# Altium project Telit-GPS-SL871-Module-V1.1.PrjPcb
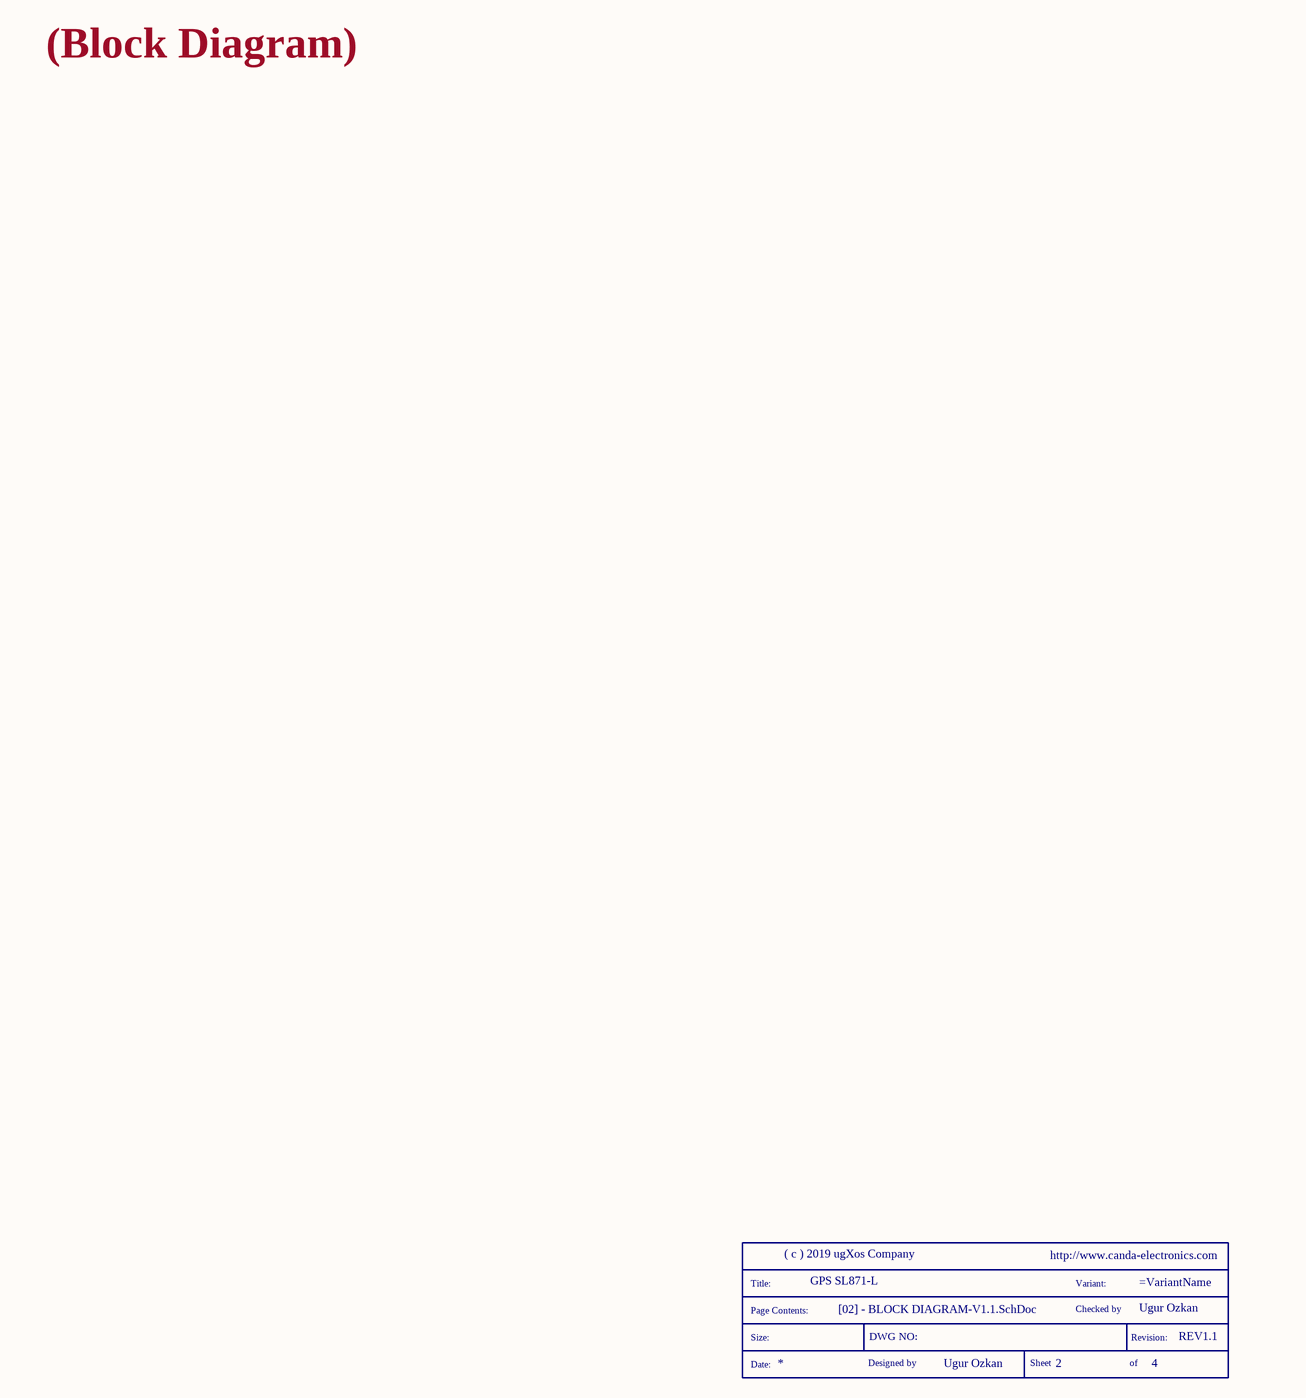
[diagram p0: [02] - BLOCK DIAGRAM-V1.1.SchDoc]
Company: ( c ) 2019 ugXos Company; Designer: Ugur Ozkan; NotFitted: NF; Project: GPS SL871-L; VersionRevision: REV1.1; WebSite: http://www.canda-electronics.com
3 sheets, 20 parts. Net scope: flat (ports and power ports of the same name join across sheets).
Board files: Telit-GPS-SL871-Module-V1.1.PcbDoc, Telit-GPS-SL871-Panel-V1.1.PcbDoc
Sheets:
  [02] - BLOCK DIAGRAM-V1.1.SchDoc
  [03] - GPS-SL871-Module-V1.1.SchDoc
  [04] - REVISION HISTORY-V1.1.SchDoc

## Sheet [02] - BLOCK DIAGRAM-V1.1.SchDoc
size A3; DocumentNumber: 2; SheetNumber: 2; SheetTotal: 4; PageSetup: Record=PageOptions|CenterHorizontal=True|CenterVertical=True|PrintScale=0.52|XCorrection=1.00|YCorrection=1.00|PrintKind=1|BorderSize=5000000|LeftOffset=0|BottomOffset=0|Orientation=2|PaperLength=1000|PaperWidth=1000|Scale=100|PaperSource=4|PrintQuality=600|MediaType=1|DitherType=10|PrintScaleMode=1|PaperKind=A4|PaperIndex=9

### Parts
(Parts that share a designator on the sheet are numbered #1, #2 ... from top to bottom, then left to right.)
*#1  SCH_TITLE  (value not drawn)  (graphical)

### Notes on the sheet
- (Block Diagram)
- (in symbol SCH_TITLE) Title:; Variant:; Page Contents:; Checked by; Size:; DWG NO:; Revision:; Date:; Designed by; Sheet; of

## Sheet [03] - GPS-SL871-Module-V1.1.SchDoc
size A4; DocumentNumber: 3; SheetNumber: 3; SheetTotal: 4
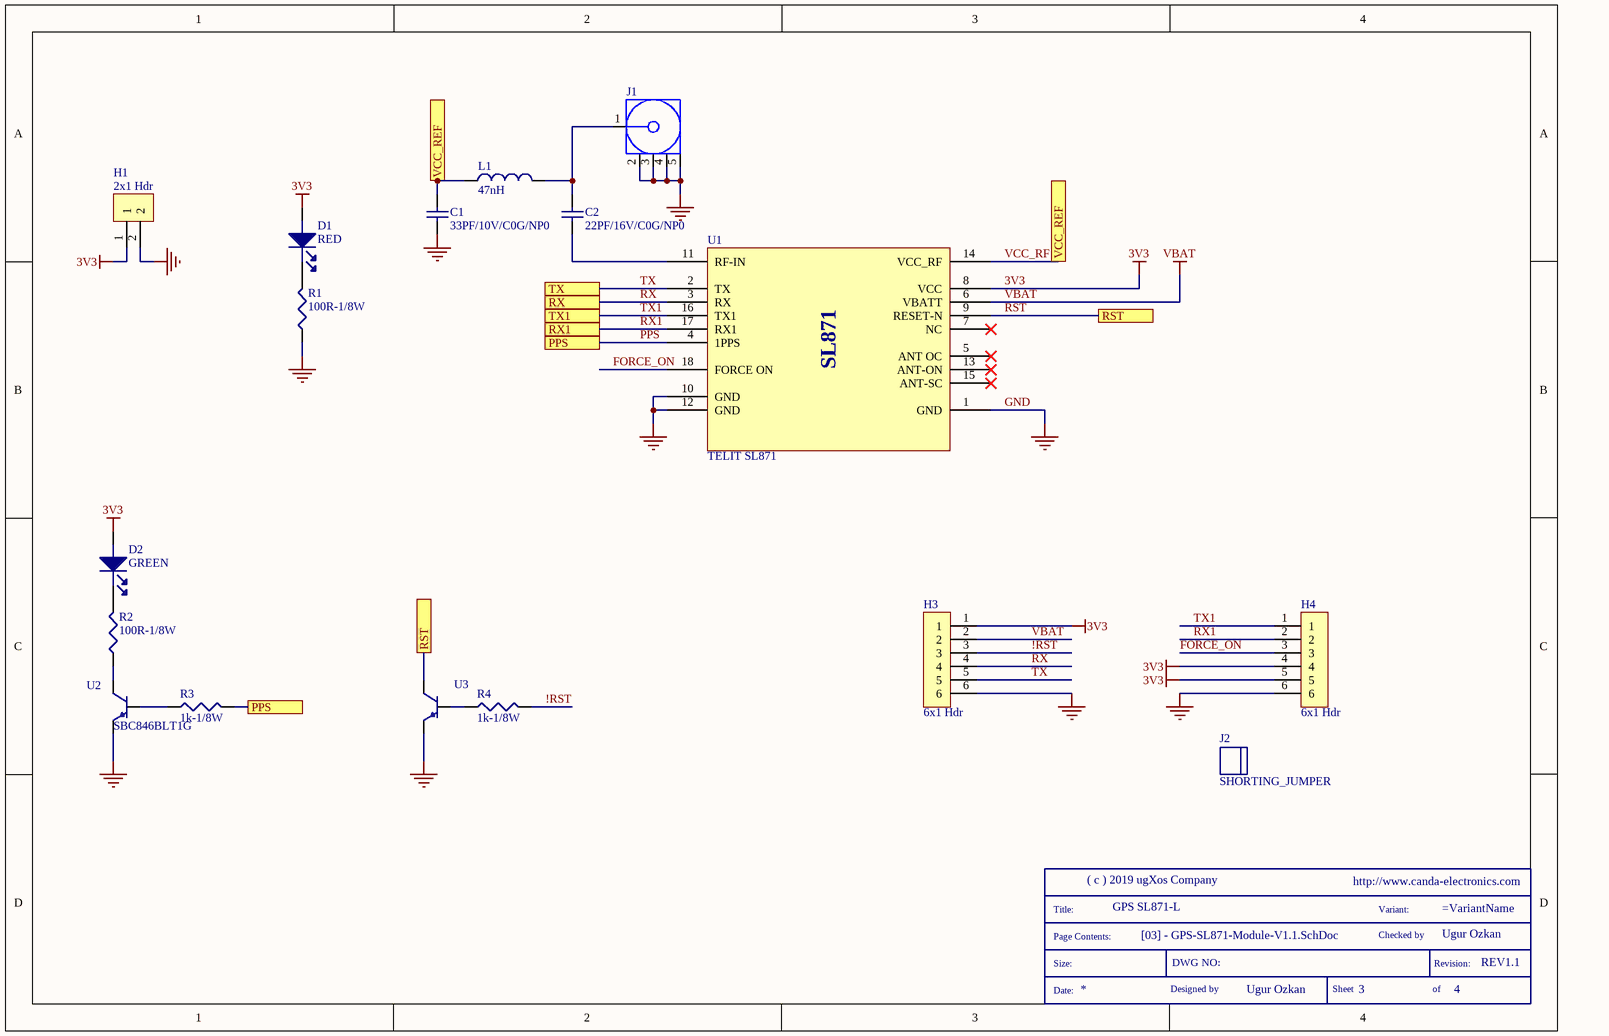
[diagram p1: [03] - GPS-SL871-Module-V1.1.SchDoc]

### Parts
(Parts that share a designator on the sheet are numbered #1, #2 ... from top to bottom, then left to right.)
*#2  SCH_TITLE  (value not drawn)  (graphical)
C1  33PF/10V/C0G/NP0  [CAP0805]
C2  22PF/16V/C0G/NP0  [CAP0805]
D1  RED  [LED_0805]
D2  GREEN  [LED_0805]
H1  2x1 Hdr  [Hdr_Male_1x2_2.54mm]
H3  6x1 Hdr  [Hdr_Female_1x6_2.54mm]
H4  6x1 Hdr  [Hdr_Female_1x6_2.54mm]
J1  WR-SMA-THT  [WR_SMA_THT_60311002114501]  (value not drawn)
J2  SHORTING_JUMPER  (graphical)
L1  47nH  [L0805]
R1  100R-1/8W  [R0805]
R2  100R-1/8W  [R0805]
R3  1k-1/8W  [R0805]
R4  1k-1/8W  [R0805]
U1  TELIT SL871  [Telit_SL871]
U2  SBC846BLT1G  [SOT-23]
U3  SBC846BLT1G  [SOT-23]  (value not drawn)

### Ports
PPS, RST, RX, RX1, TX, TX1, VCC_REF

### Nets
3V3: D1.1(Anode) D2.1(Anode) H1.1 H3.1 H4.4 H4.5 U1.8(VCC)
GND: C1.2 H1.2 H3.6 H4.6 J1.2(GND) J1.3(GND) J1.4(GND) J1.5(GND) R1.1 U1.1(GND) U1.10(GND) U1.12(GND) U2.2(E) U3.2(E)
VBAT: H3.2 U1.6(VBATT)
!RST: H3.3 R4.2
FORCE_ON: H4.3 U1.18(FORCE_ON)
PPS: R3.2 U1.4(1PPS) ; port PPS
RST: U1.9(RESET-N) U3.3(C) ; port RST
RX: H3.4 U1.3(RX) ; port RX
RX1: H4.2 U1.17(RX1) ; port RX1
TX: H3.5 U1.2(TX) ; port TX
TX1: H4.1 U1.16(TX1) ; port TX1
VCC_RF: C1.1 L1.1 U1.14(VCC_RF) ; port VCC_REF
NetC2_1: C2.1 U1.11(RF-IN)
NetC2_2: C2.2 J1.1(Signal) L1.2
NetD1_2: D1.2(Cathode) R1.2
NetD2_2: D2.2(Cathode) R2.2
NetR2_1: R2.1 U2.3(C)
NetR3_1: R3.1 U2.1(B)
NetR4_1: R4.1 U3.1(B)

Not connected (* = marked no-connect by the designer): U1 5(ANT_OC)* 7(NC)* 13(ANT-ON)* 15(ANT-SC)*

### Notes on the sheet
- (in symbol SCH_TITLE) Title:; Variant:; Page Contents:; Checked by; Size:; DWG NO:; Revision:; Date:; Designed by; Sheet; of
- (in symbol TELIT SL871) SL871

### Library data of the parts
C1 = 885012007003: CAP CER 33PF 10V C0G/NP0 0805; Manufacturer: Wurth Electronics; Tolerance: 5%; Supplier 1: Digi-Key; Manufacturer Part Number: 885012007003; RoHS: Yes; Stock 1: 2029; Pricing 1: 1 = 0,10000, 10 = 0,04100, 100 = 0,03690, 500 = 0,03262 (USD); Mount: Surface Mount; Case/Package: 0805; Case Code (Metric): 2012; Case Code (Imperial): 0805; Min Operating Temperature: -55°C; Max Operating Temperature: 125°C; Packaging: Tape and Reel; Capacitance: 33pF; Voltage Rating: 10V; Length: 0.079inch; Width: 0.049inch; Thickness: 0.028inch; Supplier Part Number 1: 732-7808-1-ND; Category: Capacitors
C2 = 885012007012: CAP CER 22PF 16V C0G/NP0 0805; Manufacturer: Wurth Electronics; Tolerance: 5%; Supplier 1: Digi-Key; Manufacturer Part Number: 885012007012; RoHS: Yes; Stock 1: 22; Pricing 1: 1 = 0,10000, 10 = 0,04300, 100 = 0,03830, 500 = 0,03390 (USD); Mount: Surface Mount; Case/Package: 0805; Case Code (Metric): 2012; Case Code (Imperial): 0805; Min Operating Temperature: -55°C; Max Operating Temperature: 125°C; Packaging: Tape and Reel; Capacitance: 22pF; Voltage Rating: 16V; Length: 0.079inch; Width: 0.049inch; Thickness: 0.028inch; Supplier Part Number 1: 732-7816-1-ND; Category: Capacitors
D1 = 150080RS75000: LED, 0805, RED, 150MCD, 625NM; Manufacturer: Wurth Electronics; Viewing Angle: 140°; Forward Voltage: 2V; Lens Style: Clear,Rectangular; Forward Current: 30mA; Test Current: 20mA; Supplier 1: Digi-Key; Manufacturer Part Number: 150080RS75000; RoHS: Yes; Stock 1: 58016; Pricing 1: 1 = 0,17000, 50 = 0,16000, 100 = 0,13700, 500 = 0,11800 (USD); Mount: Surface Mount; Case/Package: 0805; Color: Red; Case Code (Metric): 2012; Case Code (Imperial): 0805; Min Operating Temperature: -40°C; Max Operating Temperature: 85°C; Luminous Intensity: 150mcd; Wavelength: 625nm; Package Quantity: 4000; Packaging: Tape and Reel; Dominant Wavelength: 625nm; Length: 2mm; Height: 0.7mm; Width: 1.25mm; REACH SVHC: Unknown; ComponentLink1URL: http://www.farnell.com/datasheets/1911350.pdf?src-supplier=Element14; ComponentLink1Description: http://www.farnell.com/datasheets/1911350.pdf?src-supplier=Element14; ComponentLink2URL: http://www.produktinfo.conrad.com/datenblaetter/750000-774999/759435-da-01-en-CHIPLED_0805_W_KL_ROT_150080RS75000.pdf?src-supplier=Conrad; ComponentLink2Description: http://www.produktinfo.conrad.com/datenblaetter/750000-774999/759435-da-01-en-CHIPLED_0805_W_KL_ROT_150080RS75000.pdf?src-supplier=Conrad; Supplier Part Number 1: 732-4984-1-ND; Category: Optoelectronics
D2 = 150080VS75000: LED, 0805, B GREEN, 40MCD, 570NM; Manufacturer: Wurth Electronics; Forward Current: 30mA; Forward Voltage: 2V; Viewing Angle: 140°; Lens Style: Clear,Rectangular; Test Current: 20mA; Supplier 1: Digi-Key; Manufacturer Part Number: 150080VS75000; RoHS: Yes; Stock 1: 80308; Pricing 1: 1 = 0,17000, 50 = 0,16000, 100 = 0,13700, 500 = 0,11800 (USD); Mount: Surface Mount; Case/Package: 0805; Color: Green; Case Code (Metric): 2012; Case Code (Imperial): 0805; Min Operating Temperature: -40°C; Max Operating Temperature: 85°C; Luminous Intensity: 40mcd; Wavelength: 570nm; Package Quantity: 4000; Packaging: Tape and Reel; Dominant Wavelength: 570nm; Length: 2mm; Height: 0.7mm; Width: 1.25mm; REACH SVHC: Unknown; ComponentLink1URL: http://www.farnell.com/datasheets/1911352.pdf?src-supplier=Element14; ComponentLink1Description: http://www.farnell.com/datasheets/1911352.pdf?src-supplier=Element14; ComponentLink2URL: https://katalog.we-online.de/led/datasheet/150080VS75000.pdf?src-supplier=Digi-Key; ComponentLink2Description: https://katalog.we-online.de/led/datasheet/150080VS75000.pdf?src-supplier=Digi-Key; ComponentLink3URL: http://www.produktinfo.conrad.com/datenblaetter/750000-774999/759437-da-01-en-CHIPLED_0805_W_KL_H_GRUEN_150080VS7500.pdf?src-supplier=Conrad; ComponentLink3Description: http://www.produktinfo.conrad.com/datenblaetter/750000-774999/759437-da-01-en-CHIPLED_0805_W_KL_H_GRUEN_150080VS7500.pdf?src-supplier=Conrad; Supplier Part Number 1: 732-4986-1-ND; Category: Optoelectronics
H1 = 61300211121: Connector, Vertical, Through Hole, Header, 2, 2.54 Mm; Manufacturer: Wurth Electronics; Current Rating: 3A; Voltage Rating: 250V; Number of Positions: 2; Gender: Male; Connector Type: Male Pin; Pitch: 0.1inch; Supplier 1: Digi-Key; Manufacturer Part Number: 61300211121; RoHS: Yes; Stock 1: 132528; Pricing 1: 1 = 0,13000, 10 = 0,10600, 25 = 0,08800, 50 = 0,07400, 100 = 0,06700, 1000 = 0,06100 (USD); Mount: Through Hole; Contact Plating: Gold; Housing Material: PBT; Contact Material: Copper,Copper Alloy; Color: Black; Min Operating Temperature: -40°C; Max Operating Temperature: 125°C; Number of Rows: 1; Contact Gender: Male; Packaging: Bulk; Termination: Through Hole; Number of Contacts: 2; Contact Mating Length: 0.236inch; REACH SVHC: Unknown; Lead Free: Lead Free; ComponentLink1URL: http://www.mouser.com/ds/2/445/6130xx11121-538006.pdf?src-supplier=Mouser; ComponentLink1Description: http://www.mouser.com/ds/2/445/6130xx11121-538006.pdf?src-supplier=Mouser; Supplier Part Number 1: 732-5315-ND; Category: Connectors
H3 H4 = 61300611121: Connector, Vertical, Through Hole, Header 6, 2.54 Mm; Manufacturer: Wurth Electronics; Current Rating: 3A; Voltage Rating: 250V; Number of Positions: 6; Gender: Male; Connector Type: Male Pin; Pitch: 0.1inch; Supplier 1: Digi-Key; Manufacturer Part Number: 61300611121; RoHS: Yes; Stock 1: 13513; Pricing 1: 1 = 0,33000, 10 = 0,27900, 25 = 0,23200, 50 = 0,19400, 100 = 0,17600, 1000 = 0,16000 (USD); Mount: Through Hole; Contact Plating: Gold; Contact Material: Copper,Copper Alloy; Housing Material: PBT; Color: Black; Min Operating Temperature: -40°C; Max Operating Temperature: 125°C; Number of Rows: 1; Contact Gender: Male; Packaging: Bulk; Termination: Through Hole; Number of Contacts: 6; Contact Mating Length: 0.236inch; REACH SVHC: Unknown; Lead Free: Lead Free; Supplier Part Number 1: 732-5319-ND; Category: Connectors
J1 = 60311002114501: WR-SMA SMA PCB THT Jack Right Angle; Manufacturer: Wurth Electronics; Impedance: 50 Ohm; Frequency Range: DC~18 GHz; ComponentLink1Description: Manufacturer; ComponentLink1URL: http://www.we-online.de; ComponentLink2Description: Datasheet; ComponentLink2URL: https://katalog.we-online.de/em/datasheet/60311002114501.pdf; Part Number: 60311002114501; Published Date: August 2018; Publisher: Wurth Elektronik; Operating Temperature: -65 to 165 degC; Gender: Jack; Packaging: Tray; Connector Type: SMA; Orientation Type: Right Angle; Mounting Technology: THT; Manufacturer Part Number: 60311002114501; Category: Connectors
L1 = IND_0805: IND 0805
R1 R2 = ERA6AEB101V: RES SMD 100 OHM 0.1% 1/8W 0805; Manufacturer: Panasonic; Power Rating: 125mW; Voltage Rating: 100V; Resistance: 100R; Temperature Coefficient: 25ppm/°C; Supplier 1: Digi-Key; Manufacturer Part Number: ERA6AEB101V; RoHS: Yes; Stock 1: 384718; Pricing 1: 1 = 0,36000, 10 = 0,30200, 100 = 0,11820, 1000 = 0,04948, 2500 = 0,04536 (USD); Mount: Surface Mount; Case/Package: 0805; Number of Pins: 2; Case Code (Imperial): 0805; Case Code (Metric): 2012; Contact Plating: Tin; Min Operating Temperature: -55°C; Max Operating Temperature: 155°C; Tolerance: 0.1%; Packaging: Tape and Reel; Package Quantity: 1; Composition: Metal Film,Thin Film; Termination: SMD/SMT; Number of Terminations: 2; Military Standard: Not; Max Power Dissipation: 125mW; Voltage Rating (DC): 100V; Features: Automotive AEC-Q200; Length: 2mm; Height: 0.5mm; Width: 1.25mm; Depth: 1.25mm; Radiation Hardening: No; REACH SVHC: No SVHC; Lead Free: Lead Free; ComponentLink1URL: https://www.alliedelec.com/m/d/b6b0537e86f421aa7f5975bb1d8f429a.pdf?src-supplier=Allied+Electronics; ComponentLink1Description: https://www.alliedelec.com/m/d/b6b0537e86f421aa7f5975bb1d8f429a.pdf?src-supplier=Allied+Electronics; ComponentLink2URL: http://www.farnell.com/datasheets/485442.pdf?src-supplier=Farnell; ComponentLink2Description: http://www.farnell.com/datasheets/485442.pdf?src-supplier=Farnell; ComponentLink3URL: http://www.farnell.com/datasheets/485442.pdf?src-supplier=Element14; ComponentLink3Description: http://www.farnell.com/datasheets/485442.pdf?src-supplier=Element14; ComponentLink4URL: http://industrial.panasonic.com/www-data/pdf/AOA0000/AOA0000CE26.pdf?src-supplier=Avnet+Europe; ComponentLink4Description: http://industrial.panasonic.com/www-data/pdf/AOA0000/AOA0000CE26.pdf?src-supplier=Avnet+Europe; ComponentLink5URL: http://www.mouser.com/ds/2/315/AOA0000CE26-32660.pdf?src-supplier=Mouser; ComponentLink5Description: http://www.mouser.com/ds/2/315/AOA0000CE26-32660.pdf?src-supplier=Mouser; ComponentLink6URL: https://www.distrelec.biz/Web/Downloads/_t/ds/ERA_eng_tds.pdf?mime=application%2Fpdf&src-supplier=Distrelec; ComponentLink6Description: https://www.distrelec.biz/Web/Downloads/_t/ds/ERA_eng_tds.pdf?mime=application%2Fpdf&src-supplier=Distrelec; ComponentLink7URL: http://industrial.panasonic.com/www-data/pdf/AOA0000/AOA0000CE26.pdf?src-supplier=Future+Electronics; ComponentLink7Description: http://industrial.panasonic.com/www-data/pdf/AOA0000/AOA0000CE26.pdf?src-supplier=Future+Electronics; ComponentLink8URL: http://industrial.panasonic.com/www-data/pdf/AOA0000/AOA0000CE26.pdf?src-supplier=Avnet; ComponentLink8Description: http://industrial.panasonic.com/www-data/pdf/AOA0000/AOA0000CE26.pdf?src-supplier=Avnet; ComponentLink9URL: http://uk.rs-online.com/webdocs/0bee/0900766b80beefcc.pdf?src-supplier=RSComponents; ComponentLink9Description: http://uk.rs-online.com/webdocs/0bee/0900766b80beefcc.pdf?src-supplier=RSComponents; ComponentLink10URL: https://produktinfo.conrad.com/datenblaetter/450000-474999/452698-da-01-en-WIDERSTAND_0805_ERA.pdf?src-supplier=Conrad; ComponentLink10Description: https://produktinfo.conrad.com/datenblaetter/450000-474999/452698-da-01-en-WIDERSTAND_0805_ERA.pdf?src-supplier=Conrad; Supplier Part Number 1: P100DACT-ND; Category: Resistor
R3 R4 = ERA-6AED102V: Res Thin Film 0805 1K Ohm 0.5% 0.125W(1/8W) ±25ppm/C Molded SMD Automotive Punched T/R; Manufacturer: Panasonic; Resistance: 1kR; Power Rating: 125mW; Voltage Rating: 100V; Temperature Coefficient: 25ppm/°C; Supplier 1: Digi-Key; Manufacturer Part Number: ERA-6AED102V; RoHS: Yes; Stock 1: 20040; Pricing 1: 1 = 0,12000, 10 = 0,10900, 25 = 0,07520, 50 = 0,05860, 100 = 0,04180, 250 = 0,03260, 500 = 0,02592, 1000 = 0,01839 (USD); Mount: Surface Mount; Case/Package: 0805; Case Code (Imperial): 0805; Case Code (Metric): 2012; Contact Plating: Tin; Min Operating Temperature: -55°C; Max Operating Temperature: 155°C; Packaging: Tape and Reel; Tolerance: 0.5%; Package Quantity: 5000; Composition: Thin Film; Military Standard: Not; Length: 2mm; Height: 0.5mm; Width: 1.25mm; Depth: 1.25mm; Lead Free: Lead Free; ComponentLink1URL: http://industrial.panasonic.com/www-data/pdf/AOA0000/AOA0000CE26.pdf?src-supplier=Avnet; ComponentLink1Description: http://industrial.panasonic.com/www-data/pdf/AOA0000/AOA0000CE26.pdf?src-supplier=Avnet; Supplier Part Number 1: P123793CT-ND; Category: Resistor
U1 = TELIT SL871: Telit GNSS MODULE; Manufacturer Part Number: TELIT SL871; Manufacturer: Telit; Category: GSM/GPS
U2 U3 = SBC846BLT1G: BC846 NPN 65V 0.1A SOT-23; Manufacturer: ON Semiconductor; Vce Saturation (Max) @ Ib, Ic: 600mV @ 5mA, 100mA; Current - Collector Cutoff (Max): 15nA (ICBO); DC Current Gain (hFE) (Min) @ Ic, Vce: 200 @ 2mA, 5V; Frequency - Transition: 100MHz; Supplier 1: Digi-Key; Manufacturer Part Number: SBC846BLT1G; RoHS: RoHS Compliant; Category: Discrete Semiconductor Products; Stock 1: 23802; Pricing 1: 1=0.31, 10=0.256, 100=0.1356, 500=0.08922, 1000=0.06067 (USD); Packaging: Cut Tape (CT); Part Status: Active; Transistor Type: NPN; Operating Temperature: -55°C ~ 150°C (TJ); Mounting Type: Surface Mount; Package / Case: TO-236-3, SC-59, SOT-23-3; Supplier Device Package: SOT-23-3 (TO-236); ComponentLink1URL: http://www.onsemi.com/pub/Collateral/BC846ALT1-D.PDF; ComponentLink1Description: http://www.onsemi.com/pub/Collateral/BC846ALT1-D.PDF; Supplier Part Number 1: SBC846BLT1GOSCT-ND

## Sheet [04] - REVISION HISTORY-V1.1.SchDoc
size A3; DocumentNumber: 4; SheetNumber: 4; SheetTotal: 4
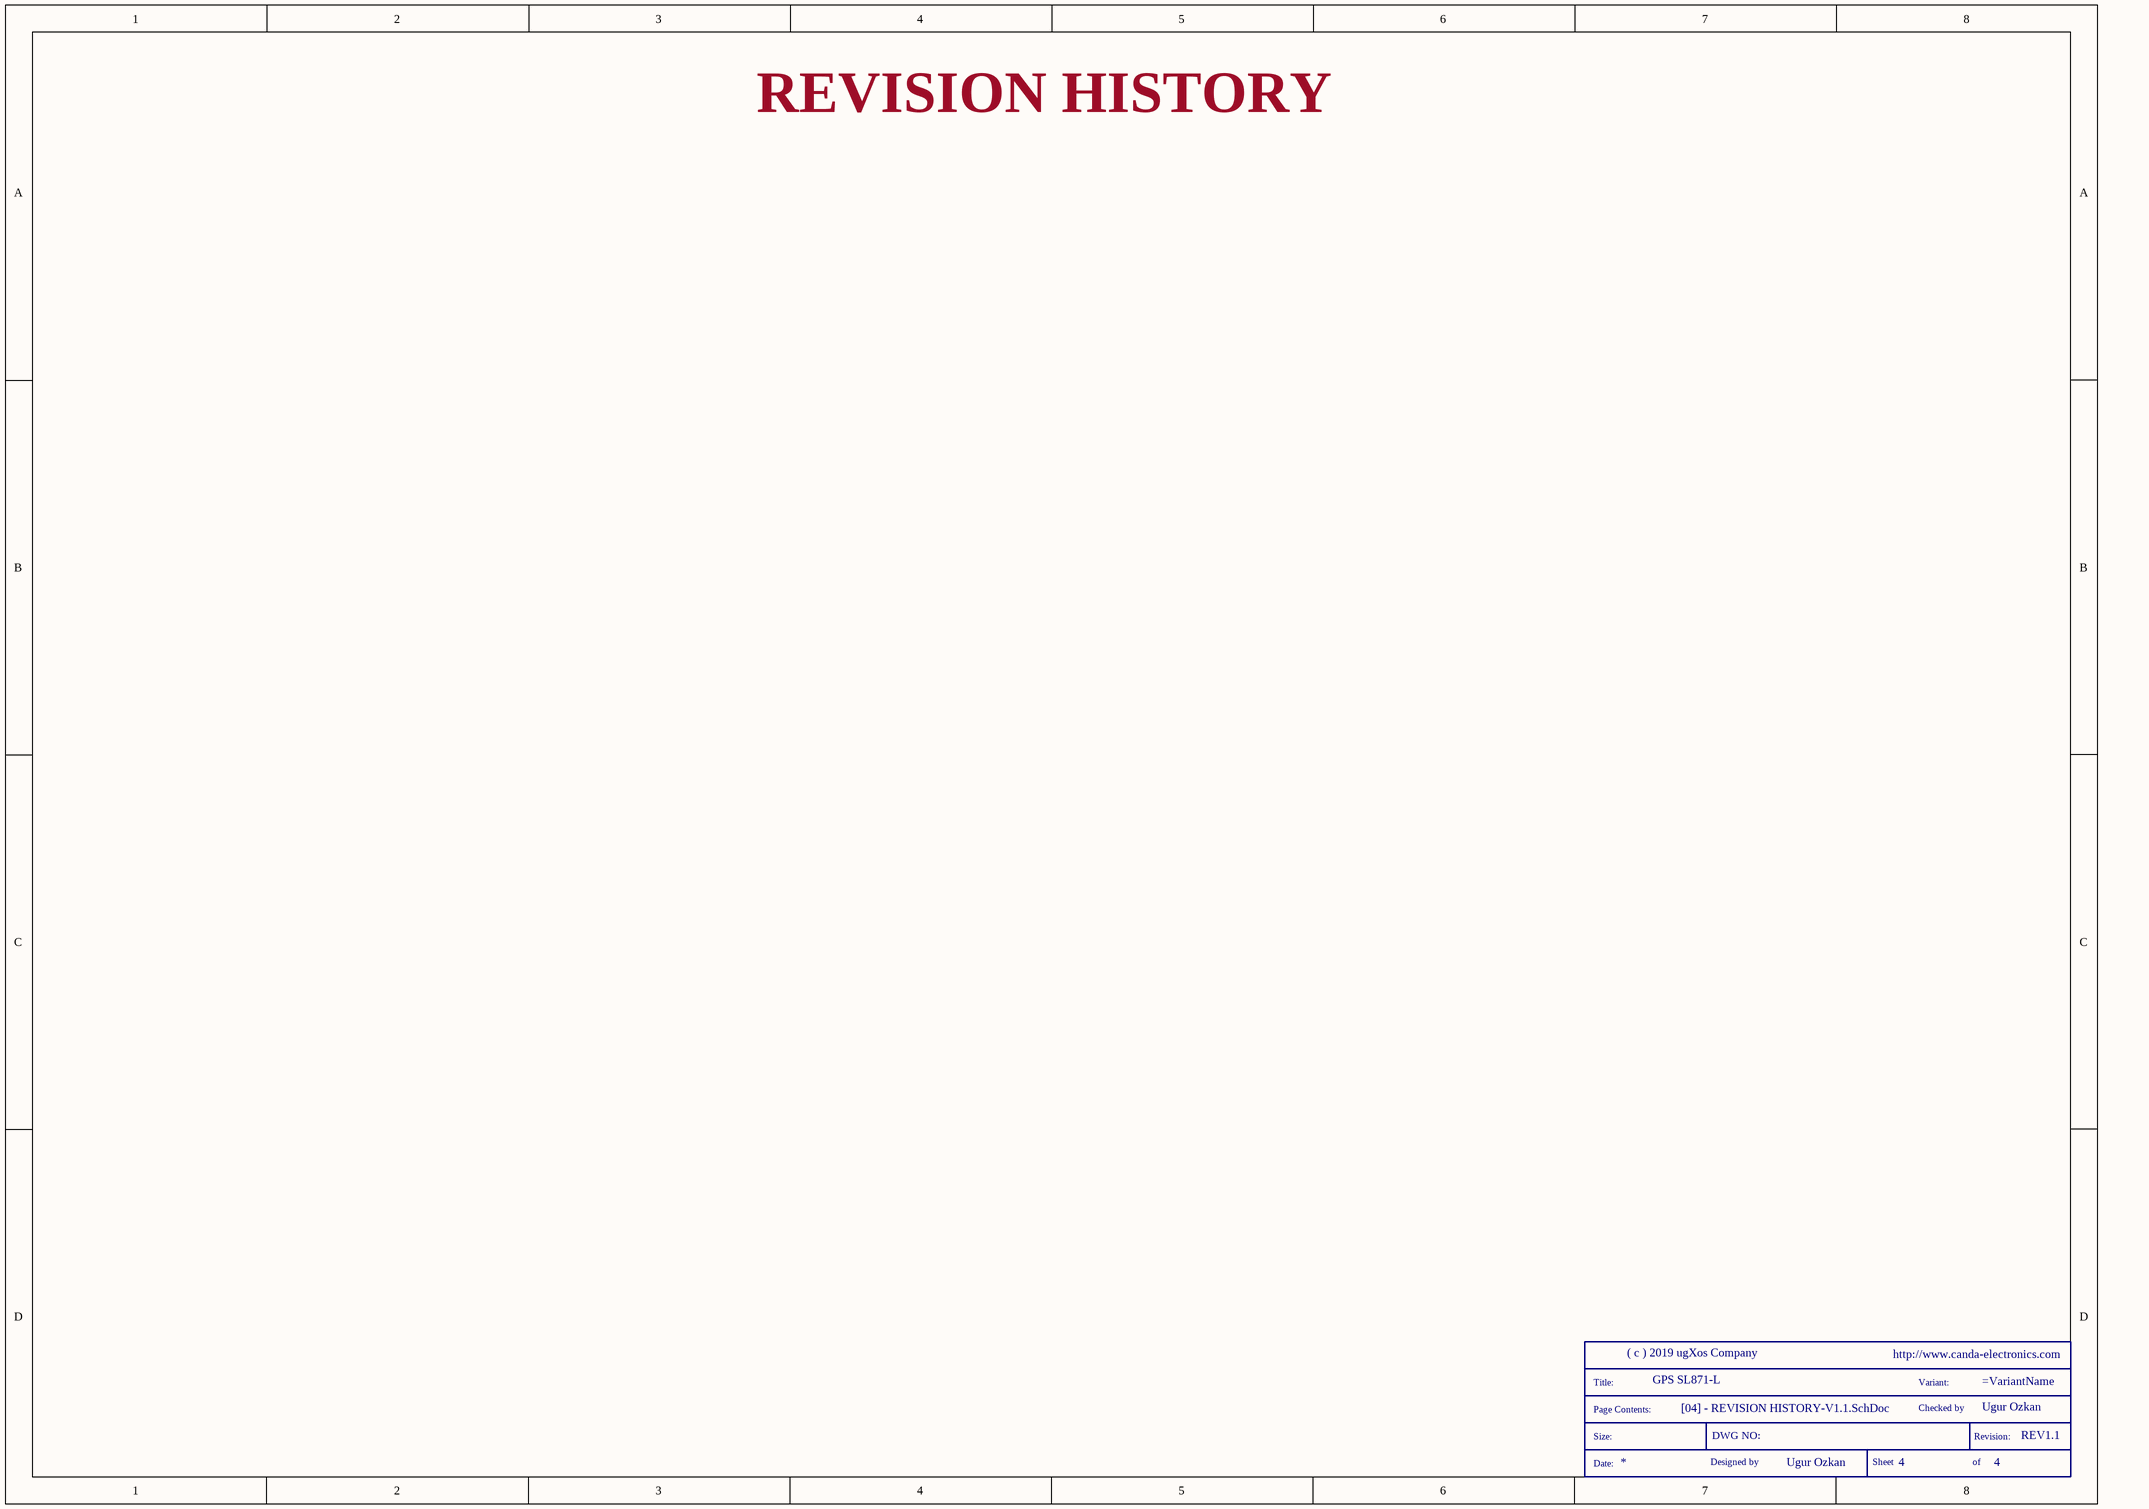
[diagram p2: [04] - REVISION HISTORY-V1.1.SchDoc]

### Parts
(Parts that share a designator on the sheet are numbered #1, #2 ... from top to bottom, then left to right.)
*#3  SCH_TITLE  (value not drawn)  (graphical)

### Notes on the sheet
- REVISION HISTORY
- (in symbol SCH_TITLE) Title:; Variant:; Page Contents:; Checked by; Size:; DWG NO:; Revision:; Date:; Designed by; Sheet; of